# Altium project Step_Motor_2.0.PrjPcb
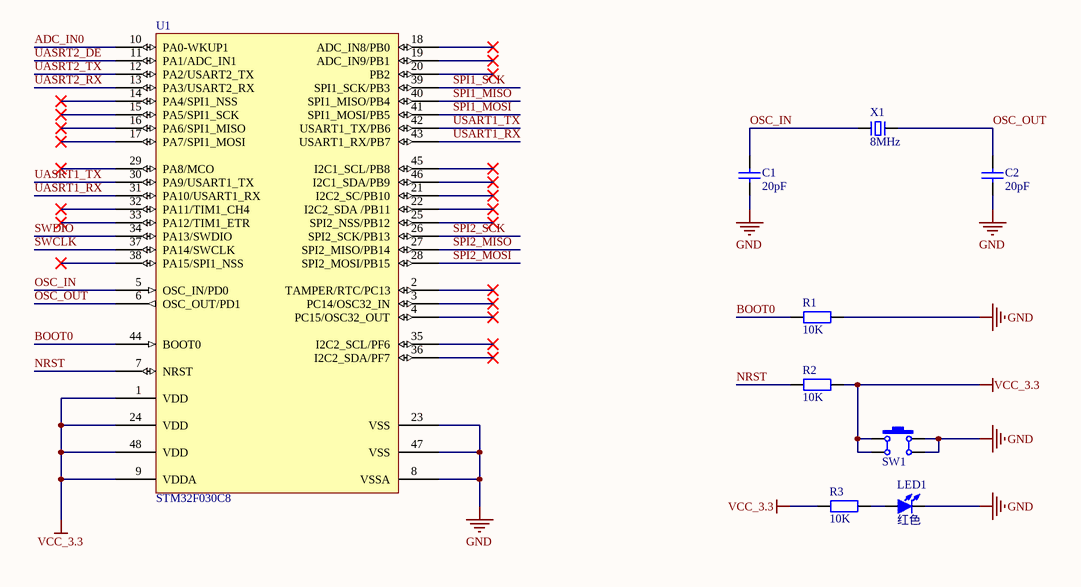
[diagram p0: MCU.SchDoc]
2 sheets, 10 parts. Net scope: global (net labels, ports and power ports of the same name join across sheets).
Sheets:
  MCU.SchDoc
  Communication.SchDoc

## Sheet MCU.SchDoc
size A4; SheetNumber: 1; SheetTotal: 2

### Parts
C1  20pF  [C0402_L]
C2  20pF  [C0402_L]
LED1  红色  [LED0603_R]
R1  10K  [R0402_L]
R2  10K  [R0402_L]
R3  10K  [R0402_L]
SW1  4x4x1.5  [SW SMD-4*4*1.5]  (value not drawn)
U1  STM32F030C8  [LQFP48 7X7_N]
X1  8MHz  [OSC HC-49S]

### Nets
GND: C1.1 C2.1 LED1.2(K) R1.2 SW1.2 SW1.3 U1.8(VSSA) U1.23(VSS) U1.47(VSS)
VCC_3.3: R2.2 R3.1 SW1.1 SW1.4 U1.1(VDD) U1.9(VDDA) U1.24(VDD) U1.48(VDD)
ADC_IN0: U1.10(PA0-WKUP1)
BOOT0: R1.1 U1.44(BOOT0)
NRST: R2.1 U1.7(NRST)
OSC_IN: C1.2 U1.5(OSC_IN/PD0) X1.1
OSC_OUT: C2.2 U1.6(OSC_OUT/PD1) X1.2
SPI1_MISO: U1.40(SPI1_MISO/PB4)
SPI1_MOSI: U1.41(SPI1_MOSI/PB5)
SPI1_SCK: U1.39(SPI1_SCK/PB3)
SPI2_MISO: U1.27(SPI2_MISO/PB14)
SPI2_MOSI: U1.28(SPI2_MOSI/PB15)
SPI2_SCK: U1.26(SPI2_SCK/PB13)
SWCLK: U1.37(PA14/SWCLK)
SWDIO: U1.34(PA13/SWDIO)
UASRT1_RX: U1.31(PA10/USART1_RX)
UASRT1_TX: U1.30(PA9/USART1_TX)
UASRT2_DE: U1.11(PA1/ADC_IN1)
UASRT2_RX: U1.13(PA3/USART2_RX)
UASRT2_TX: U1.12(PA2/USART2_TX)
USART1_RX: U1.43(USART1_RX/PB7)
USART1_TX: U1.42(USART1_TX/PB6)
NetLED1_1: LED1.1(A) R3.2

Not connected (* = marked no-connect by the designer): U1 2(TAMPER/RTC/PC13)* 3(PC14/OSC32_IN)* 4(PC15/OSC32_OUT)* 14(PA4/SPI1_NSS)* 15(PA5/SPI1_SCK)* 16(PA6/SPI1_MISO)* 17(PA7/SPI1_MOSI)* 18(ADC_IN8/PB0)* 19(ADC_IN9/PB1)* 20(PB2)* 21(I2C2_SC/PB10)* 22(I2C2_SDA_/PB11)* 25(SPI2_NSS/PB12)* 29(PA8/MCO)* 32(PA11/TIM1_CH4)* 33(PA12/TIM1_ETR)* 35(I2C2_SCL/PF6)* 36(I2C2_SDA/PF7)* 38(PA15/SPI1_NSS)* 45(I2C1_SCL/PB8)* 46(I2C1_SDA/PB9)*

### Library data of the parts
C1 C2 = C: 贴片电容; 0.0_BOM名称: 无极性贴片电容; 3.交流分享: Q群514746572,开源更新,欢迎一起交流学习PCB设计; 4.作者声明: 旨为整合最全库集,欢迎转载,禁止商用！-冰凌猫; 5.备注说明: 该库已二次整合过网上各热销库,基本最全,无需重复搜购安装; 1.库作者: 冰凌猫; 2.库版本: v2.0 (2021.03.30)
LED1 = LED-SMD: 贴片LED; 1.库作者: 冰凌猫; 2.库版本: v2.0 (2021.03.30); 3.交流分享: Q群514746572,开源更新,欢迎一起交流学习PCB设计; 4.作者声明: 旨为整合最全库集,欢迎转载,禁止商用！-冰凌猫; 5.备注说明: 该库已二次整合过网上各热销库,基本最全,无需重复搜购安装; 0.0_BOM名称: 贴片LED
R1-R3 = R: 贴片电阻; 3.交流分享: Q群514746572,开源更新,欢迎一起交流学习PCB设计; 4.作者声明: 旨为整合最全库集,欢迎转载,禁止商用！-冰凌猫; 5.备注说明: 该库已二次整合过网上各热销库,基本最全,无需重复搜购安装; 1.库作者: 冰凌猫; 2.库版本: v2.0 (2021.03.30); 0.0_BOM名称: 贴片电阻
SW1 = TSW SMD-4x4: 贴片4x4轻触开关; 1.库作者: 冰凌猫; 2.库版本: v2.0 (2021.03.30); 3.交流分享: Q群514746572,开源更新,欢迎一起交流学习PCB设计; 4.作者声明: 旨为整合最全库集,欢迎转载,禁止商用！-冰凌猫; 5.备注说明: 该库已二次整合过网上各热销库,基本最全,无需重复搜购安装; 0.0_BOM名称: 贴片4x4轻触开关
U1 = STM32F030C8: Flaah:64/RAM:8/IO:39; 1.库作者: 冰凌猫; 2.库版本: v2.0 (2021.03.30); 3.交流分享: Q群514746572,开源更新,欢迎一起交流学习PCB设计; 4.作者声明: 旨为整合最全库集,欢迎转载,禁止商用！-冰凌猫; 5.备注说明: 该库已二次整合过网上各热销库,基本最全,无需重复搜购安装
X1 = XTAL-2P: 2脚无源脚晶振; 1.库作者: 冰凌猫; 2.库版本: v2.0 (2021.03.30); 3.交流分享: Q群514746572,开源更新,欢迎一起交流学习PCB设计; 4.作者声明: 旨为整合最全库集,欢迎转载,禁止商用！-冰凌猫; 5.备注说明: 该库已二次整合过网上各热销库,基本最全,无需重复搜购安装; 0.0_BOM名称: 2脚无源脚晶振

## Sheet Communication.SchDoc
size A4; SheetNumber: 2; SheetTotal: 2
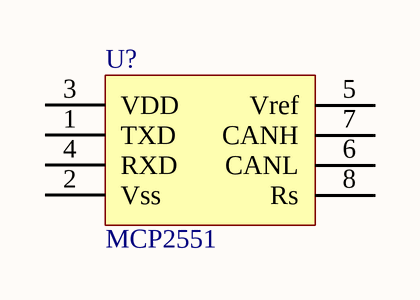
[diagram p1: Communication.SchDoc]

### Parts
U?  MCP2551  [SO-8N]

### Nets

Not connected (* = marked no-connect by the designer): U? 1(TXD) 2(Vss) 3(VDD) 4(RXD) 5(Vref) 6(CANL) 7(CANH) 8(Rs)

### Library data of the parts
U? = MCP2551: CAN收发器; 1.库作者: 冰凌猫; 2.库版本: v2.0 (2021.03.30); 3.交流分享: Q群514746572,开源更新,欢迎一起交流学习PCB设计; 4.作者声明: 旨为整合最全库集,欢迎转载,禁止商用！-冰凌猫; 5.备注说明: 该库已二次整合过网上各热销库,基本最全,无需重复搜购安装